# EAGLE schematic Smart Greenhouse (EAGLE 9.6.2)
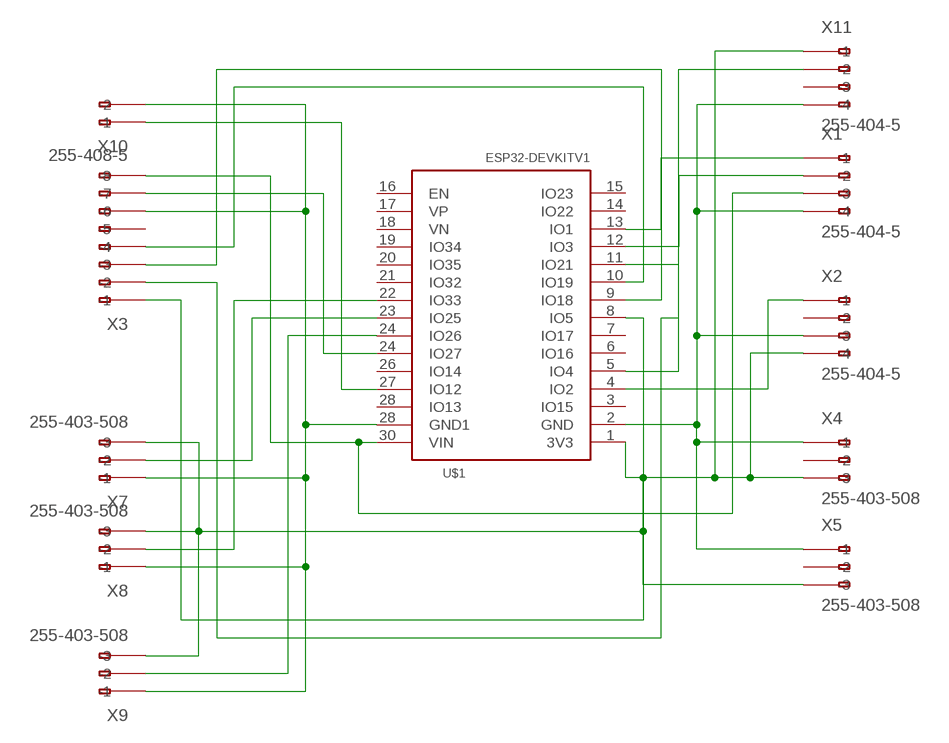
[diagram p0: schematic, sheet 1]

## Parts
U$1  ESP32DEVKITV1  [ESP32-DEVKITV1]
X1  255-404-5  [255-404-5]
X2  255-404-5  [255-404-5]
X3  255-408-5  [255-408-5]
X4  255-403-508  [255-403-508]
X5  255-403-508  [255-403-508]
X7  255-403-508  [255-403-508]
X8  255-403-508  [255-403-508]
X9  255-403-508  [255-403-508]
X10  255-402-508  [255-402-508]
X11  255-404-5  [255-404-5]

## Nets
N$1: U$1.28(GND1) X3.A6(-6) X7.A1(-1) X8.A1(-1) X9.A1(-1) X10.A2(-2)
N$2: U$1.13(IO1) X1.A1(-1)
N$3: U$1.2(GND) X1.A4(-4) X2.A3(-3) X4.A1(-1) X5.A1(-1) X11.A4(-4)
N$4: U$1.12(IO3) X1.A2(-2)
N$5: U$1.30(VIN) X1.A3(-3) X3.A8(-8)
N$6: U$1.24(IO26) X9.A2(-2)
N$7: U$1.24(IO27) X3.A7(-7)
N$8: U$1.10(IO19) X3.A4(-4)
N$9: U$1.9(IO18) X3.A3(-3)
N$11: U$1.11(IO21) X3.A2(-2)
N$12: U$1.22(IO33) X8.A2(-2)
N$13: U$1.23(IO25) X7.A2(-2)
N$14: U$1.8(IO5) X3.A1(-1)
N$15: U$1.27(IO12) X10.A1(-1)
N$16: U$1.4(IO2) X2.A1(-1)
N$17: U$1.5(IO4) X11.A2(-2)
N$18: U$1.1(3V3) X2.A4(-4) X4.A3(-3) X5.A3(-3) X7.A3(-3) X8.A3(-3) X9.A3(-3) X11.A1(-1)
Unconnected: U$1.3(IO15) U$1.6(IO16) U$1.7(IO17) U$1.14(IO22) U$1.15(IO23) U$1.16(EN) U$1.17(VP) U$1.18(VN) U$1.19(IO34) U$1.20(IO35) U$1.21(IO32) U$1.26(IO14) U$1.28(IO13) X1.B1(B-1) X1.B2(B-2) X1.B3(B-3) X1.B4(B-4) X2.A2(-2) X2.B1(B-1) X2.B2(B-2) X2.B3(B-3) X2.B4(B-4) X3.A5(-5) X3.B1(B-1) X3.B2(B-2) X3.B3(B-3) X3.B4(B-4) X3.B5(B-5) X3.B6(B-6) X3.B7(B-7) X3.B8(B-8) X4.A2(-2) X4.B1(B-1) X4.B2(B-2) X4.B3(B-3) X5.A2(-2) X5.B1(B-1) X5.B2(B-2) X5.B3(B-3) X7.B1(B-1) X7.B2(B-2) X7.B3(B-3) X8.B1(B-1) X8.B2(B-2) X8.B3(B-3) X9.B1(B-1) X9.B2(B-2) X9.B3(B-3) X10.B1(B-1) X10.B2(B-2) X11.A3(-3) X11.B1(B-1) X11.B2(B-2) X11.B3(B-3) X11.B4(B-4)

## Library data of the parts
U$1 = ESP32-DEVKITV1:ESP32DEVKITV1
X1 X2 X11 = con-wago255:255-404-5: WAGO; OC_FARNELL: unknown; OC_NEWARK: unknown
X3 = con-wago255:255-408-5: WAGO; OC_FARNELL: unknown; OC_NEWARK: unknown
X4 X5 X7-X9 = con-wago255:255-403-5: WAGO; OC_FARNELL: unknown; OC_NEWARK: unknown
X10 = con-wago255:255-402-5: WAGO; OC_FARNELL: unknown; OC_NEWARK: unknown